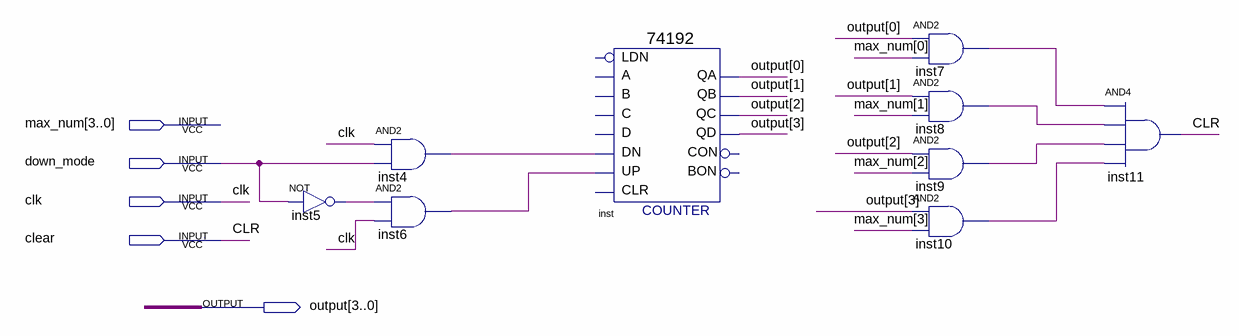
[diagram p0: schematic sheet]
// Quartus schematic 74192Counter.bdf as structural Verilog: 9 symbols, 5 pins
module \74192Counter  (
  input  [3:0] max_num,
  input  down_mode,
  input  clk,
  input  clear,
  output [3:0] \output 
);

  wire inst4_out, inst5_out, inst6_out, inst7_out, inst8_out, inst9_out, inst10_out;

  not inst5 (inst5_out, down_mode);
  and inst4 (inst4_out, clk, down_mode);
  and inst6 (inst6_out, inst5_out, clk);
  \74192  inst (
    .UP(inst6_out), .DN(inst4_out), .QB(\output [1]), .QA(\output [0]), .QC(\output [2]), .QD(\output [3]));  // open: D, C, A, B, CLR, LDN, BON, CON
  and inst7 (inst7_out, \output [0], max_num[0]);
  and inst8 (inst8_out, \output [1], max_num[1]);
  and inst9 (inst9_out, \output [2], max_num[2]);
  and inst10 (inst10_out, \output [3], max_num[3]);
  and inst11 (clear, inst7_out, inst8_out, inst9_out, inst10_out);

  // Other names for the same wires on the sheet: CLR = clear
endmodule
